# EAGLE design nrf24_tiny84 (EAGLE 6.4)
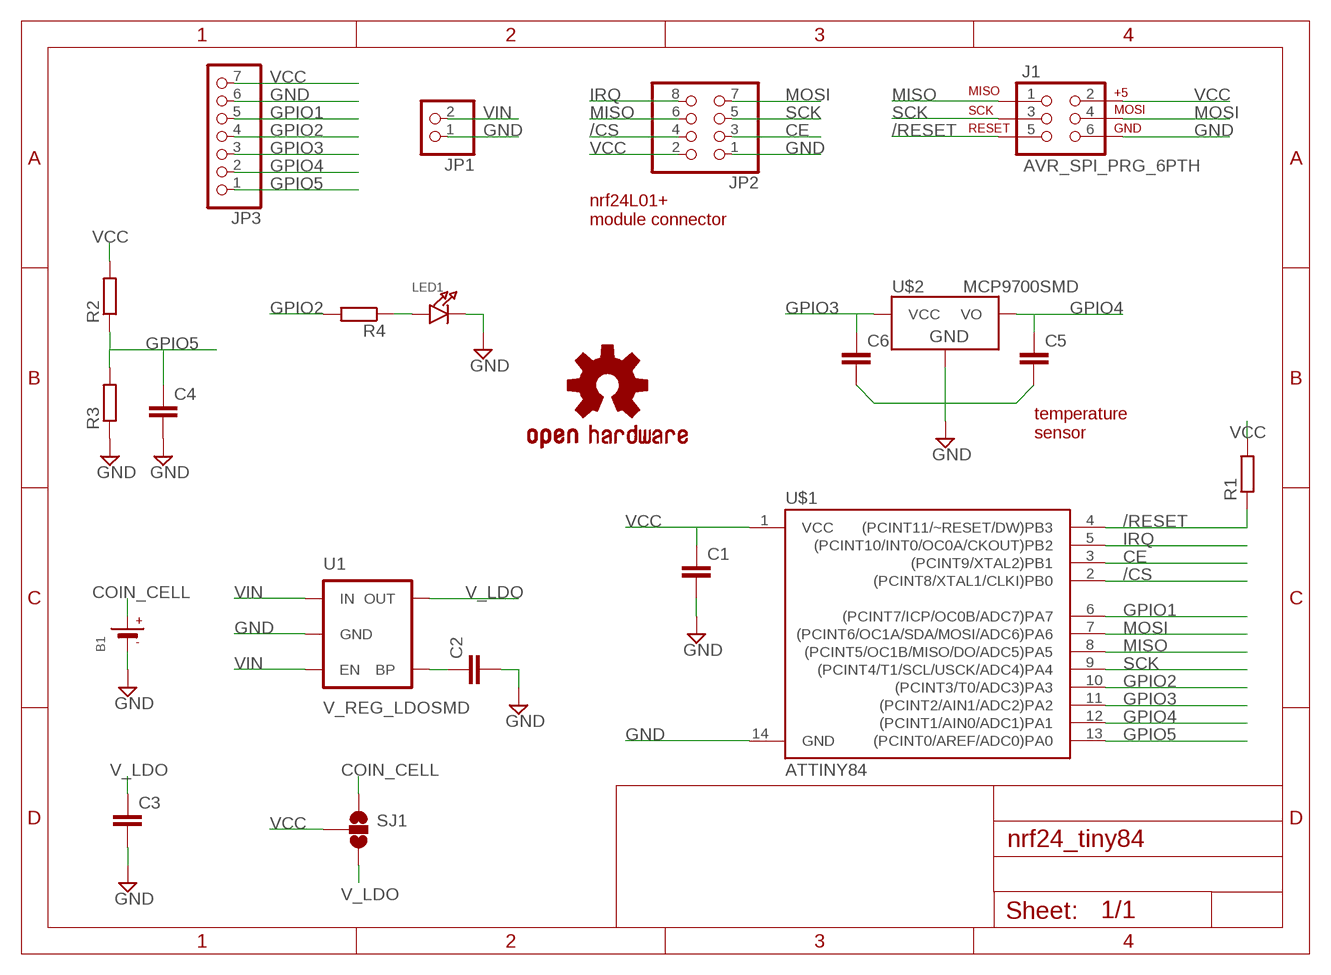
[diagram p0: schematic, sheet 1]

## Parts
B1  BATTERYCR2032  [CR2032]
C1  C-EUC0805  [C0805]
C2  C-EUC0805  [C0805]
C3  C-EUC0805  [C0805]
C4  C-EUC0805  [C0805]
C5  C-EUC0805  [C0805]
C6  C-EUC0805  [C0805]
J1  AVR_SPI_PRG_6PTH  [2X3]
JP1  HEADER-1X2ROUND  [1X02_ROUND]
JP2  PINHD-2X4  [2X04]
JP3  HEADER-1X7ROUND  [1X07_ROUND]
LED1  LED0805  [CHIPLED_0805]
LOGO1  OSHW-LOGOS  [OSHW-LOGO-S]
R1  R-EU_R0805  [R0805]
R2  R-EU_R0805  [R0805]
R3  R-EU_R0805  [R0805]
R4  R-EU_R0805  [R0805]
SJ1  SOLDERJUMPER_2WAYS  [SJ_3]
U1  V_REG_LDOSMD  [SOT23-5]
U$1  ATTINY84  [SO14]
U$2  MCP9700SMD  [SOT23-3]

## Nets
/CS: JP2.4 U$1.2((PCINT8/XTAL1/CLKI)PB0)
/RESET: J1.5 R1.1 U$1.4((PCINT11/~RESET/DW)PB3)
CE: JP2.3 U$1.3((PCINT9/XTAL2)PB1)
COIN_CELL: B1.+ SJ1.1
GND: B1.- C1.2 C2.2 C3.2 C4.2 C5.2 C6.2 J1.6 JP1.1 JP2.1 JP3.6 LED1.C R3.1 U1.2(GND) U$1.14(GND) U$2.3(GND)
GPIO1: JP3.5 U$1.6((PCINT7/ICP/OC0B/ADC7)PA7)
GPIO2: JP3.4 R4.2 U$1.10((PCINT3/T0/ADC3)PA3)
GPIO3: C6.1 JP3.3 U$1.11((PCINT2/AIN1/ADC2)PA2) U$2.1(VCC)
GPIO4: C5.1 JP3.2 U$1.12((PCINT1/AIN0/ADC1)PA1) U$2.2(VO)
GPIO5: C4.1 JP3.1 R2.1 R3.2 U$1.13((PCINT0/AREF/ADC0)PA0)
IRQ: JP2.8 U$1.5((PCINT10/INT0/OC0A/CKOUT)PB2)
MISO: J1.1 JP2.6 U$1.8((PCINT5/OC1B/MISO/DO/ADC5)PA5)
MOSI: J1.4 JP2.7 U$1.7((PCINT6/OC1A/SDA/MOSI/ADC6)PA6)
N$1: C2.1 U1.4(BP)
N$2: LED1.A R4.1
SCK: J1.3 JP2.5 U$1.9((PCINT4/T1/SCL/USCK/ADC4)PA4)
V_LDO: C3.1 SJ1.3 U1.5(OUT)
VCC: C1.1 J1.2 JP2.2 JP3.7 R1.2 R2.2 SJ1.2 U$1.1(VCC)
VIN: JP1.2 U1.1(IN) U1.3(EN)

## Notes on the sheet
- nrf24L01+ 
  module connector
- temperature
  sensor

## Library data of the parts
B1 = microbuilder:BATTERY: CR1220 SMT - Digikey: 3001K-ND
C1-C6 = rcl:C-EU: CAPACITOR, European symbol
J1 = SparkFun-Connectors:AVR_SPI_PRG_6: AVR ISP 6 Pin This is the reduced ISP connector for AVR programming. Common on Arduino. This footprint will take up less PCB space and can be used with a 10-pin to 6-pin adapter such as SKU: BOB-08508
JP1 = microbuilder:HEADER-1X2: PIN HEADER
JP2 = pinhead:PINHD-2X4: PIN HEADER
JP3 = microbuilder:HEADER-1X7: PIN HEADER
LED1 = microbuilder:LED: LED 0603 - 0603 Surface Mount Package 2mA: Green LED - Low Power (3.9mcd, 2ma, 1.7Vf) - Digikey: 475-2709-2-ND Orange LED - Low Power (9.8mcd, 2ma, 1.8Vf) - Digikey: 475-1194-2-ND Red LED - Low Power (5mcd, 2ma, 1.8Vf) - Digikey: 475-1195-2-ND Yellow LED - Low Power (7mcd, 2ma, 1.8Vf) - Digikey: 475-1196-2-ND 5mA: Blue LED - Low Power (17mcd, 5ma, 2.9Vf) - Digikey: LNJ937W8CRACT-ND 0805 - 0805 Surface Mount Package 2mA: Red LED (8.8mcd, 2mA, 1.8Vf, Clear) - Low Power [Digikey: 475-2510-1-ND] Green LED (5mcd, 2mA, 1.8Vf, Clear) - Low Power [Digikey: 475-2730-1-ND] Yellow LED (11.3mcd, 2mA, 1.8Vf, Clear) - Low Power [Digikey: 475-2555-1-ND] 20mA: Red LED (104mcd, 20mA, Diffused) - LS R976 [Digikey: 475-1278-6-ND] Red LED (12mcd, 20mA, 2.0Vf, Clear) - APT2012EC [Digikey: 754-1128-1-ND] Green LED (15mcd, 20mA, 2.2Vf, Clear) - APT2012GC [Digikey: 754-1131-1-ND] Orange LED (160mcd, 20mA, 2.1Vf, Clear) - APT2012SECK [Digikey: 754-1130-1-ND] 1206 - 1206 Surface Mount Package Green LED (26mcd, 20mA, Diffused) - LG N971 [Digikey: 475-1407-6-ND] Red LED (15mcd, 20mA, Diffused) - LH N974 [Digikey: 475-1416-6-ND]
LOGO1 = SparkFun-Aesthetics:OSHW-LOGO: Open Source Hardware Logo This logo indicates the piece of hardware it is found on incorporates a OSHW license and/or adheres to the definition of open source hardware found here: http://freedomdefined.org/OSHW
R1-R4 = rcl:R-EU_: RESISTOR, European symbol
SJ1 = SparkFun-Passives:SOLDERJUMPER_2WAY: Solder Jumper 2 way solder jumper
U1 = SparkFun-PowerIC:V_REG_LDO: Voltage Regulator LDO Standard 150mA LDO voltage regulator in SOT-23 layout. Micrel part MIC5205. BP (by-pass) pin is used to lower output noise with 470pF cap.
U$1 = SparkFun-DigitalIC:ATTINY84: Atmel 14-pin 2/4/8kB flash uC
U$2 = SparkFun-Sensors:MCP9700: Analog-output temperature sensor

## Board
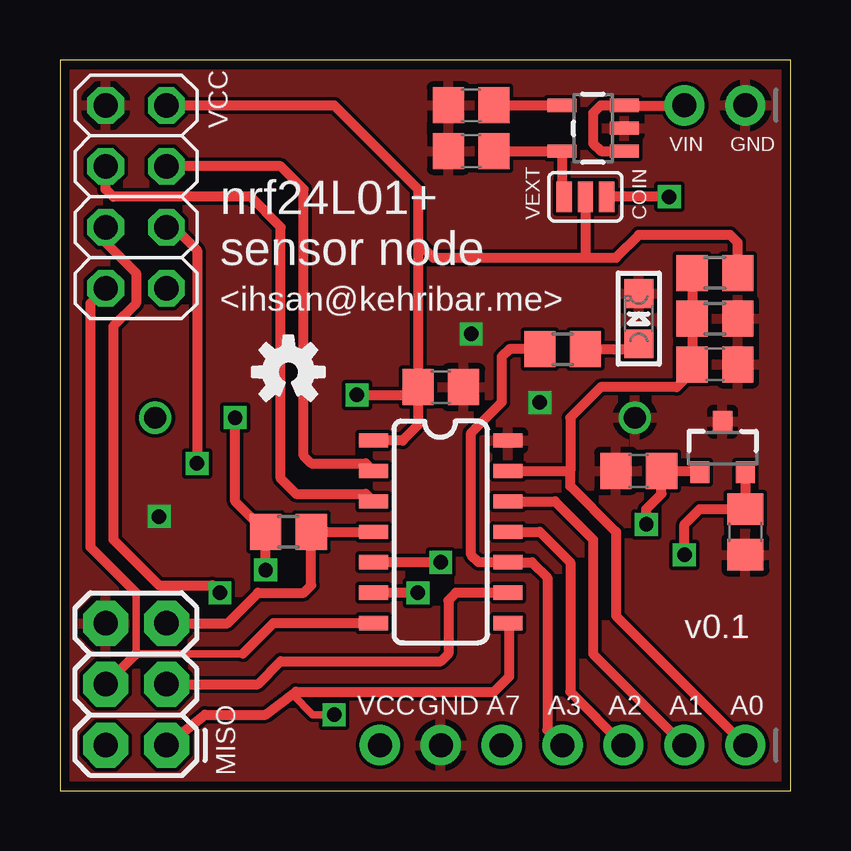
[diagram p1: board, top side]
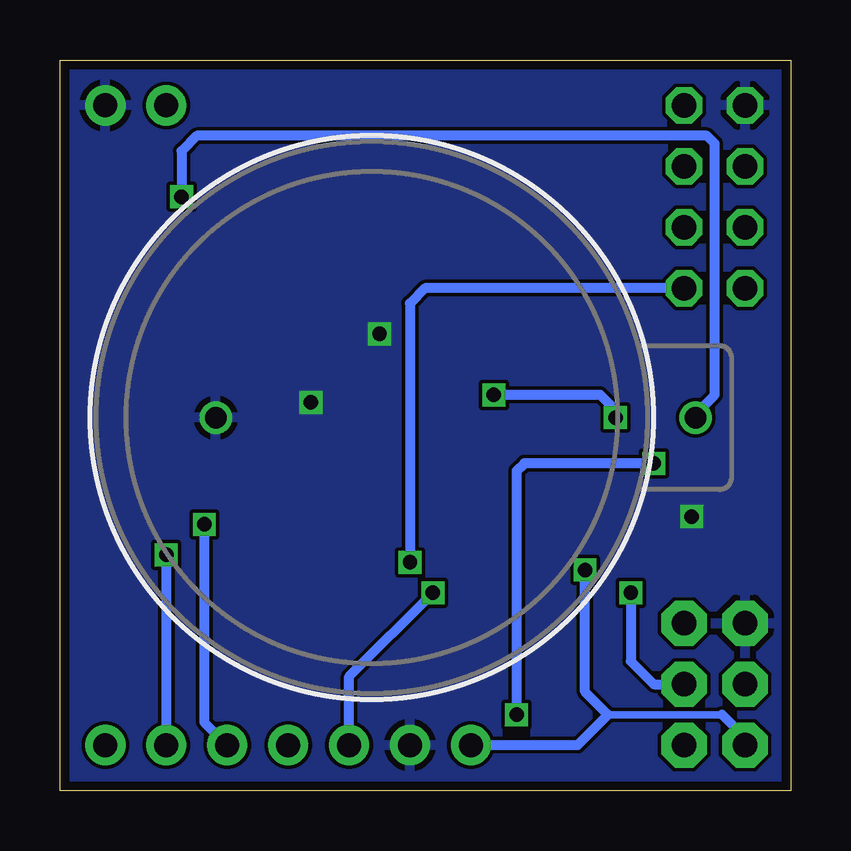
[diagram p2: board, bottom side, seen from below]

Size 30.47 x 30.47 mm. Coordinates in mm from the lower left corner, seen from the top.
Outline: 0,0 30.47,0 30.47,30.47 0,30.47 0,0
Copper layers (1*16): Top 0.0356mm / dielectric 1.5011mm / Bottom 0.0356mm
Design rules "LaenPCBOrder": minimum track width 6mil, minimum drill 13mil, track to track 6mil, track to pad 6mil, pad to pad 6mil, via to via 6mil, smd to smd 6mil, copper to edge 15mil, drill to drill 6mil, minimum pad ring 7mil, minimum via ring 7mil, stop-mask expansion 4mil, vias tented up to drill 0mil, thermal gap 10mil

### Footprints (pad centres in the part's own frame; a part is rotated, then mirrored left to right if it is on the bottom)
CR2032 = drill 0.9: + 10,0; - -10,0
C0805 = smd 1.3 x 1.5: 1 -0.95,0; 2 0.95,0
2X3 = drill 1.016 pad 1.88 octagon: 1 0,0; 2 0,2.54; 3 2.54,0; 4 2.54,2.54; 5 5.08,0; 6 5.08,2.54
1X02_ROUND = drill 1 pad 1.676: 1 -1.27,0; 2 1.27,0
2X04 = drill 1.016 octagon: 1 -3.81,-1.27; 2 -3.81,1.27; 3 -1.27,-1.27; 4 -1.27,1.27; 5 1.27,-1.27; 6 1.27,1.27; 7 3.81,-1.27; 8 3.81,1.27
1X07_ROUND = drill 1 pad 1.676: 1 -7.62,0; 2 -5.08,0; 3 -2.54,0; 4 0,0; 5 2.54,0; 6 5.08,0; 7 7.62,0
CHIPLED_0805 = smd 1.2 x 1.2: A 0,-1.05; C 0,1.05
R0805 = smd 1.3 x 1.5: 1 -0.95,0; 2 0.95,0
SJ_3 = smd 0.635 x 1.27: 1 -0.889,0; 2 0,0; 3 0.889,0
SOT23-5 = smd 0.55 x 1.2: 1 -0.95,-1.3; 2 0,-1.3; 3 0.95,-1.3; 4 0.95,1.3; 5 -0.95,1.3
SO14 = smd 0.6 x 1.2: 1 -3.81,-2.8; 2 -2.54,-2.8; 3 -1.27,-2.8; 4 0,-2.8; 5 1.27,-2.8; 6 2.54,-2.8; 7 3.81,-2.8; 8 3.81,2.8; 9 2.54,2.8; 10 1.27,2.8; 11 0,2.8; 12 -1.27,2.8; 13 -2.54,2.8; 14 -3.81,2.8
SOT23-3 = smd 0.8 x 0.9: 1 -0.95,-1; 2 0.95,-1; 3 0,1.1

### Placement (x,y rotation side)
B1  13.97,15.56 0 bottom
C1  15.88,16.83 0 top
C2  17.14,28.57 180 top
C3  17.14,26.67 180 top
C4  27.3,17.78 0 top
C5  28.57,10.79 270 top
C6  24.13,13.34 180 top
J1  4.45,1.91 90 top
JP1  27.3,28.57 180 top
JP2  3.17,24.77 270 top
JP3  20.95,1.91 180 top
LED1  24.13,19.68 0 top
LOGO1  9.53,17.46 0 top
R1  9.53,10.79 180 top
R2  27.3,21.59 0 top
R3  27.3,19.68 180 top
R4  20.95,18.41 180 top
SJ1  21.91,24.77 180 top
U1  22.23,27.62 90 top
U$1  15.88,10.79 270 top
U$2  27.62,14.29 0 top

### Tracks (layer width: path | path; a pad name or v marks a point on that pad's centre or on a via)
/CS
  Top 0.406: JP2.4 9.21,26.04 10.16,25.08 10.16,13.97 10.48,13.65 12.76,13.65 U$1.2
/RESET
  Top 0.406: U$1.4 R1.1 10.48,8.57 10.16,8.26 8.26,8.26 6.99,6.99 J1.5
CE
  Top 0.406: JP2.3 1.91,25.08 2.22,24.77 7.94,24.77 9.21,23.5 9.21,13.02 9.84,12.38 12.76,12.38 U$1.3
COIN_CELL  (via drill 0.6)
  Top 0.406: v25.4,24.77 SJ1.1
  Bottom 0.406: B1.+ 3.97,15.71 3.17,16.51 3.17,26.99 3.49,27.3 24.77,27.3 25.4,26.67 v25.4,24.77
GND  (via drill 0.6)
  other vias: 4.13,11.43 20,16.19 17.14,19.05
  pour Top: -0.32,-0.32 30.8,-0.32 30.8,30.8 -0.32,30.8
  pour Bottom: 0,0 30.48,0 30.48,30.48 0,30.48
GPIO1  (via drill 0.6)
  Top 0.406: v14.92,8.26 U$1.6
  Bottom 0.406: JP3.5 18.41,4.76 v14.92,8.26
GPIO2
  Top 0.406: R4.2 19.68,18.41 18.73,18.41 18.41,18.1 18.41,16.19 17.14,14.92 17.14,9.84 17.46,9.53 U$1.10 19.68,9.53 20.32,8.89 20.32,2.54 JP3.4
GPIO3  (via drill 0.6)
  Top 0.406: U$1.11 20,10.79 21.27,9.53 21.27,4.13 JP3.3 | U$2.1 26.72,13.34 C6.1 25.08,12.38 24.45,11.75 v24.45,11.11
  Bottom 0.406: v24.45,11.11 24.45,2.86 JP3.3
GPIO4  (via drill 0.6)
  Top 0.406: U$1.12 20.64,12.06 22.23,10.48 22.23,5.71 JP3.2 | U$2.2 C5.1 | v26.04,9.84 26.04,11.11 26.67,11.75 C5.1 | C5.1
  Bottom 0.406: v26.04,9.84 JP3.2
GPIO5
  Top 0.406: U$1.13 21.27,13.34 | R2.1 R3.2 C4.1 26.36,17.46 25.72,16.83 22.54,16.83 21.27,15.56 21.27,13.34 | JP3.1 23.18,7.3 23.18,10.79 21.27,12.7 21.27,13.34
IRQ  (via drill 0.6)
  Top 0.406: v15.88,9.53 U$1.5
  Bottom 0.406: JP2.8 15.24,20.95 15.88,20.32 v15.88,9.53
MISO  (via drill 0.6)
  Top 0.305: v11.43,3.17 10.53,3.17 9.69,4.01
  Top 0.406: JP2.6 4.76,23.5 5.71,22.54 v5.71,13.65 | J1.1 6.03,3.17 8.57,3.17 9.69,4.01 9.84,4.13 18.1,4.13 18.73,4.76 18.73,6.93 U$1.8
  Bottom 0.406: v5.71,13.65 11.11,13.65 11.43,13.34 v11.43,3.17
MOSI
  Top 0.305: 7.62,5.71 3.17,5.71 3.17,8.26
  Top 0.406: 3.17,5.71 J1.4 | U$1.7 8.89,6.99 7.62,5.71 | JP2.7 1.27,20.32 1.27,10.16 3.17,8.26
N$1
  Top 0.406: C2.1 U1.4
N$2
  Top 0.406: R4.1 23.91,18.41 LED1.A
SCK  (via drill 0.6)
  Top 0.406: J1.3 8.26,4.45 9.21,5.4 15.88,5.4 16.19,5.71 16.19,7.94 16.51,8.26 U$1.9 | JP2.5 1.91,22.86 3.17,21.59 3.17,20.32 2.22,19.37 2.22,10.48 4.13,8.57 6.35,8.57 v6.67,8.26
  Bottom 0.406: v6.67,8.26 6.67,5.4 5.71,4.45 J1.3
V_LDO
  Top 0.406: SJ1.3 20.93,24.86 U1.5 C3.1
VCC  (via drill 0.6)
  Top 0.406: SJ1.2 21.91,22.23 | C1.1 14.93,15.24 14.29,14.61 U$1.1 | JP2.2 11.43,28.57 14.92,25.08 14.92,22.86 | 14.92,22.86 C1.1 | 14.92,22.86 15.56,22.23 21.91,22.23 | v7.3,15.56 7.3,12.06 R1.2 8.57,10.16 v8.57,9.21 | v12.38,16.51 14.61,16.51 C1.1 | 21.91,22.23 23.18,22.23 24.13,23.18 27.94,23.18 28.26,22.86 28.26,22.23 R2.2
  Bottom 0.305: 2.86,3.17 7.62,3.17
  Bottom 0.406: J1.2 1.91,2.22 2.86,3.17 | JP3.7 8.89,1.91 7.62,3.17 8.57,4.13 v8.57,9.21 | v7.3,15.56 7.3,15.88 7.94,16.51 v12.38,16.51
VIN
  Top 0.406: JP1.2 U1.3 22.54,28.57 22.23,28.26 22.23,26.99 22.54,26.67 U1.1

### Text on the board
tNames: VCC | VIN | GND | VEXT | COIN | nrf24L01+ / sensor node | <ihsan@kehribar.me> | v0.1 | VCC | GND | A7 | A3 | A2 | A1 | A0 | MISO